# EAGLE design bitcoinChart (EAGLE 9.2.2)
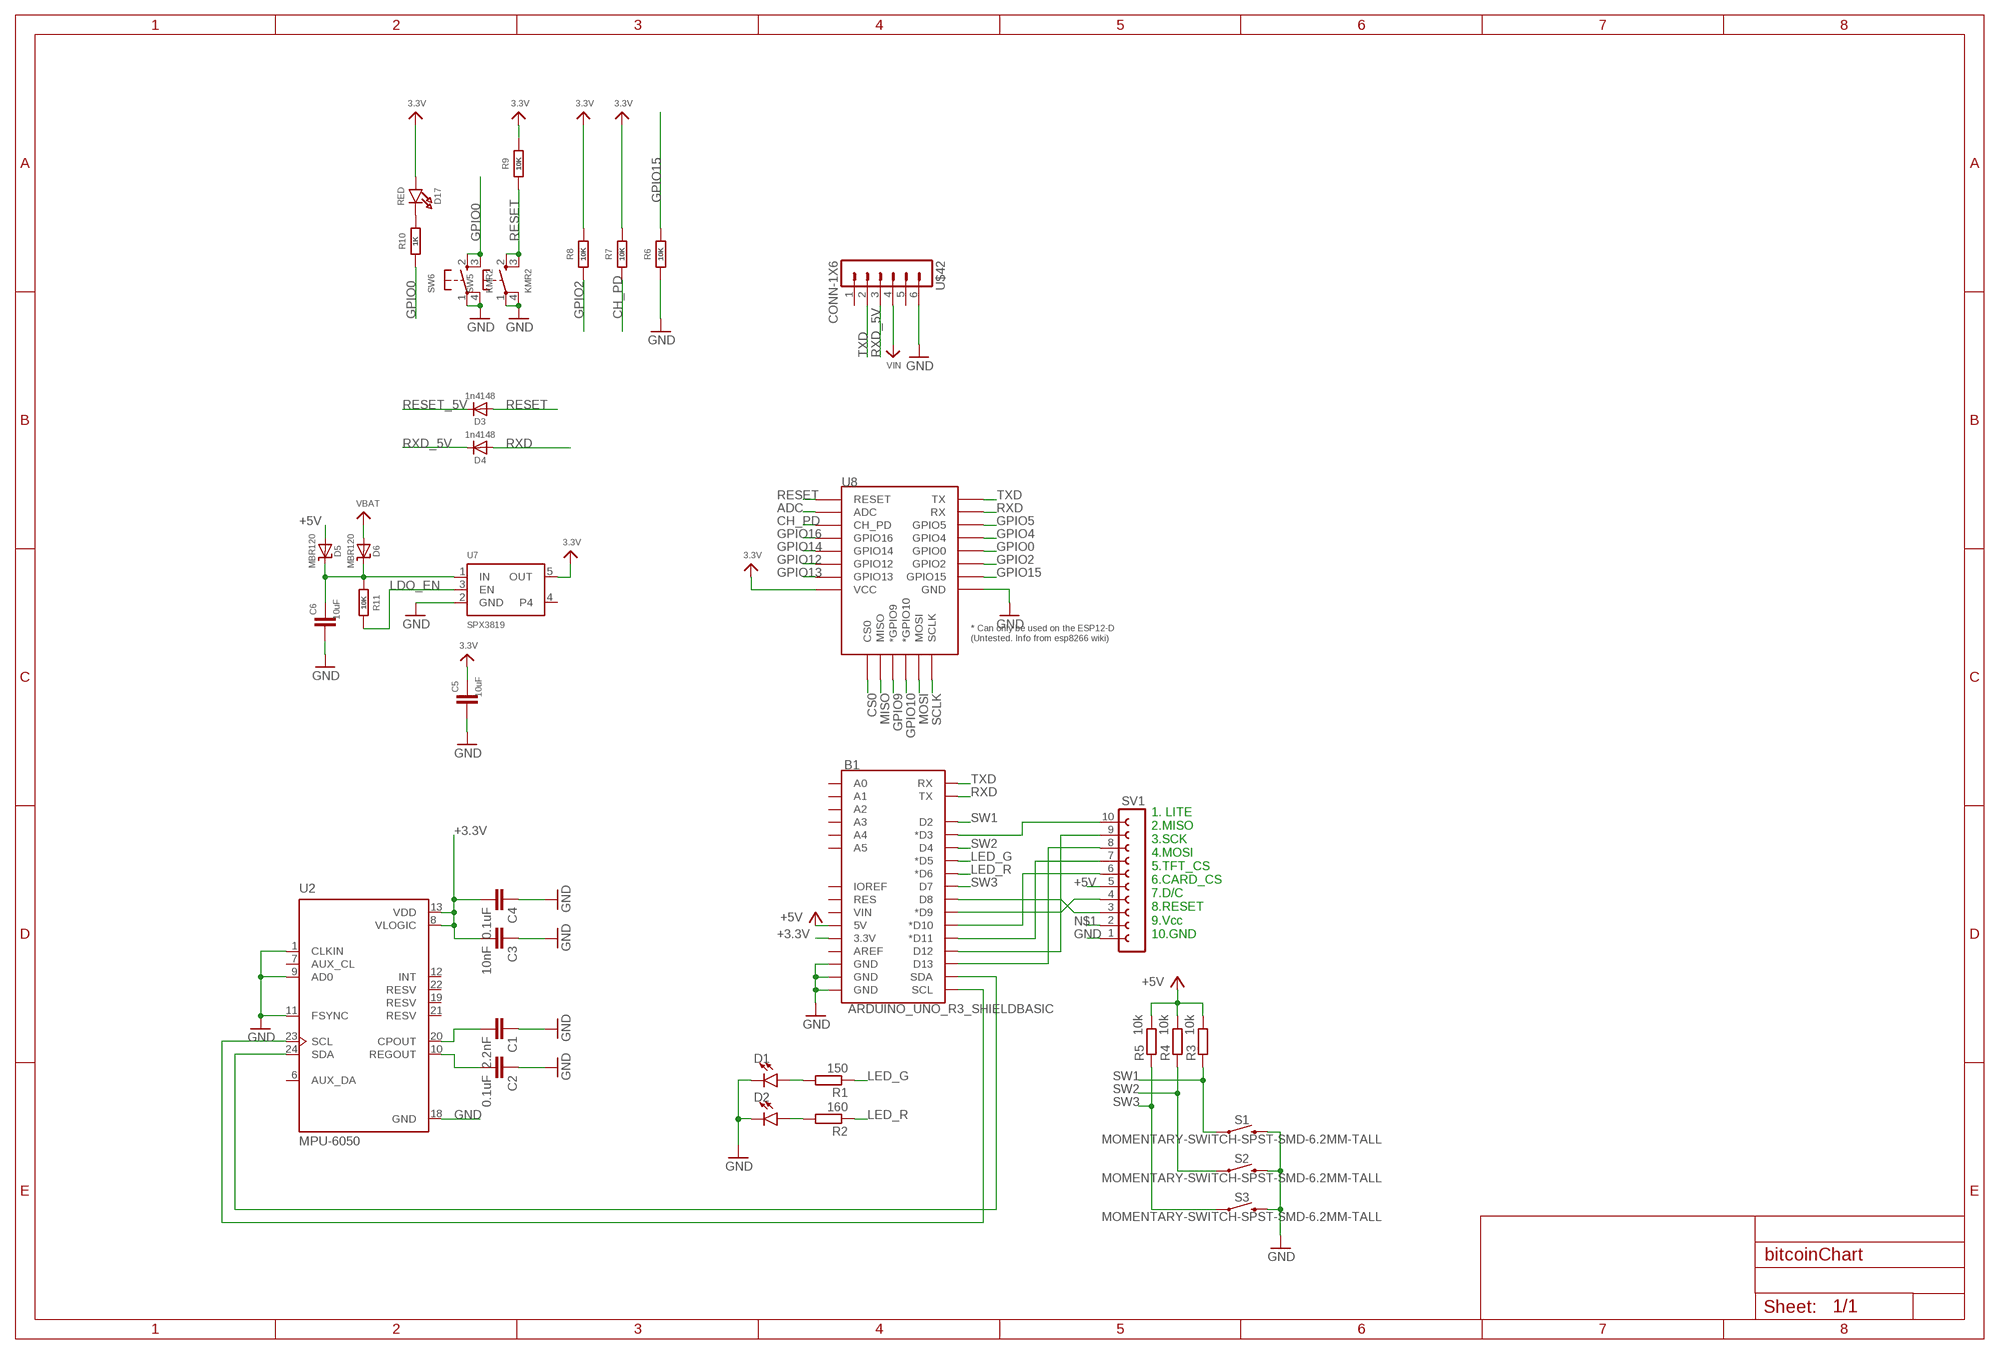
[diagram p0: schematic, sheet 1]

## Parts
B1  ARDUINO_UNO_R3_SHIELDBASIC  [UNO_R3_SHIELD]
C1  2.2nF  C-EUC1206K  [C1206K]
C2  0.1uF  C-EUC1206K  [C1206K]
C3  10nF  C-EUC1206K  [C1206K]
C4  0.1uF  C-EUC1206K  [C1206K]
C5  10uF  SMD-CAPACITOR0805  [C0805K]
C6  10uF  SMD-CAPACITOR0805  [C0805K]
D1  GREEN  LEDCHIPLED_0805  [CHIPLED_0805]
D2  RED  LEDCHIPLED_0805  [CHIPLED_0805]
D3  1n4148  DIODESOD-323  [SOD-323]
D4  1n4148  DIODESOD-323  [SOD-323]
D5  MBR120  DIODE-SCHOTTKYSOD-123  [SOD-123]
D6  MBR120  DIODE-SCHOTTKYSOD-123  [SOD-123]
D17  RED  LED  [LED_0805]
R1  150  R-EU_M1206  [M1206]
R2  160  R-EU_M1206  [M1206]
R3  10k  R-EU_M1206  [M1206]
R4  10k  R-EU_M1206  [M1206]
R5  10k  R-EU_M1206  [M1206]
R6  10K  SMD-RESISTORR0805  [R0805]
R7  10K  SMD-RESISTORR0805  [R0805]
R8  10K  SMD-RESISTORR0805  [R0805]
R9  10K  SMD-RESISTORR0805  [R0805]
R10  1K  SMD-RESISTORR0805  [R0805]
R11  10K  SMD-RESISTORR0805  [R0805]
S1  MOMENTARY-SWITCH-SPST-SMD-6.2MM-TALL  [TACTILE_SWITCH_SMD_6.2MM_TALL]
S2  MOMENTARY-SWITCH-SPST-SMD-6.2MM-TALL  [TACTILE_SWITCH_SMD_6.2MM_TALL]
S3  MOMENTARY-SWITCH-SPST-SMD-6.2MM-TALL  [TACTILE_SWITCH_SMD_6.2MM_TALL]
SV1  FE10-1  [FE10]
SW5  KMR2  BUTTON_KMR2KMR2  [BTN_KMR2]
SW6  KMR2  BUTTON_KMR2KMR2  [BTN_KMR2]
U2  MPU-6050  [QFN50P400X400X95-24N]
U7  SPX3819  MIC5219SOT-23-5  [SOT-23-5]
U8  ESP12ESMD  [ESP12E-SMD]
U$42  CONN-1X6  [GHI-HEADERS_TH-1X6]

## Nets
3.3V [3v]: C5.1 D17.A R7.2 R8.2 R9.2 U7.5(OUT) U8.VCC
+3.3V [test]: B1.3.3V C3.2 C4.2 U2.8(VLOGIC) U2.13(VDD)
+5V [test]: B1.5V D5.2(A) R3.2 R4.2 R5.2 SV1.5
ADC: U8.ADC
CH_PD: R7.1 U8.CH_PD
CS0: U8.CS0
GND [test]: B1.GND@0(GND) B1.GND@1(GND) B1.GND@2(GND) C1.1 C2.1 C3.1 C4.1 C5.2 C6.2 D1.C D2.C R6.1 S1.B2 S2.B2 S3.B2 SV1.1 SW5.1(P) SW5.4(P1) SW6.1(P) SW6.4(P1) U2.1(CLKIN) U2.9(AD0) U2.11(FSYNC) U2.18(GND) U7.2(GND) U8.GND U$42.6
GPIO0: R10.1 SW6.2(S) SW6.3(S1) U8.GPIO0
GPIO2: R8.1 U8.GPIO2
GPIO4: U8.GPIO4
GPIO5: U8.GPIO5
GPIO9: U8.GPIO9(*GPIO9)
GPIO10: U8.GPIO10(*GPIO10)
GPIO12: U8.GPIO12
GPIO13: U8.GPIO13
GPIO14: U8.GPIO14
GPIO15: R6.2 U8.GPIO15
GPIO16: U8.GPIO16
LDO_EN: R11.2 U7.3(EN)
LED_G: B1.D5(*D5) R1.1
LED_R: B1.D6(*D6) R2.1
MISO: U8.MISO
MOSI: U8.MOSI
N$1 [test]: SV1.2
N$2: B1.SCL U2.23(SCL)
N$3: B1.SDA U2.24(SDA)
N$4: B1.D3(*D3) SV1.10
N$5: B1.D8 SV1.3
N$6: B1.D13 SV1.8
N$7: B1.D11(*D11) SV1.7
N$8: B1.D10(*D10) SV1.6
N$9: B1.D9(*D9) SV1.4
N$10: C2.2 U2.10(REGOUT)
N$11: C1.2 U2.20(CPOUT)
N$12: B1.D12 SV1.9
N$13: D1.A R1.2
N$14: C6.1 D5.1(C) D6.1(C) R11.1 U7.1(IN)
N$15: D17.K(C) R10.2
N$16: D2.A R2.2
RESET: D3.2(A) R9.1 SW5.2(S) SW5.3(S1) U8.RESET
RESET_5V: D3.1(C)
RXD: B1.TX D4.2(A) U8.RXD0(RX)
RXD_5V: D4.1(C) U$42.3
SCLK: U8.SCLK
SW1: B1.D2 R3.1 S1.A2
SW2: B1.D4 R4.1 S2.A2
SW3: B1.D7 R5.1 S3.A2
TXD: B1.RX U8.TXD0(TX) U$42.2
VBAT: D6.2(A)
VIN: U$42.4
Unconnected: B1.A0 B1.A1 B1.A2 B1.A3 B1.A4 B1.A5 B1.AREF B1.IOREF B1.RES B1.VIN U2.6(AUX_DA) U2.7(AUX_CL) U2.12(INT) U2.19(RESV) U2.21(RESV) U2.22(RESV) U7.4 U$42.1 U$42.5

## Notes on the sheet
- 1. LITE
  2.MISO
  3.SCK
  4.MOSI
  5.TFT_CS
  6.CARD_CS
  7.D/C
  8.RESET
  9.Vcc
  10.GND

## Library data of the parts
B1 = SparkFun-Boards:ARDUINO_UNO_R3_SHIELD: Arduino R3 Shield Footprint Shield form compatible with the Arduino Uno R3. SparkFun Products: MG2639 Cellular Shield <https://www.sparkfun.com/products/13120> MIDI Shield <https://www.sparkfun.com/products/12898> R3 Stackable Headers Kit <https://www.sparkfun.com/products/11417>
C1-C4 = resistor:C-EU: CAPACITOR, European symbol
C5 C6 = basic_components:SMD-CAPACITOR
D1 D2 = led:LED: LED
D3 D4 = basic_components:DIODE
D5 D6 = basic_components:DIODE-SCHOTTKY
D17 = basic_components:LED: LED
R1-R5 = resistor:R-EU_: RESISTOR, European symbol
R6-R11 = basic_components:SMD-RESISTOR
S1-S3 = SparkFun-Switches:MOMENTARY-SWITCH-SPST: Momentary Switch (Pushbutton) - SPST Normally-open (NO) SPST momentary switches (buttons, pushbuttons). Variants PTH-12MM - 12mm square, through-hole Momentary Pushbutton Switch - 12mm Square <https://www.sparkfun.com/products/9190> (COM-09190) PTH-6.0MM, PTH-6.0MM-KIT - 6.0mm square, through-hole Mini Pushbutton Switch <https://www.sparkfun.com/products/97> (COM-00097) KIT package intended for soldering kit's - only one side of pads' copper is exposed. PTH-RIGHT-ANGLE-KIT - Right-angle, through-hole Right Angle Tactile Button <https://www.sparkfun.com/products/10791> - Used on SparkFun BigTime Watch Kit <https://www.sparkfun.com/products/11734> SMD-12MM - 12mm square, surface-mount Tactile Button - SMD (12mm) <https://www.sparkfun.com/products/12993> (COM-12993) Used on SparkFun PicoBoard <https://www.sparkfun.com/products/11888> SMD-4.5MM - 4.5mm Square Trackball Switch Used on SparkFun Blackberry Trackballer Breakout <https://www.sparkfun.com/products/13169> SMD-4.6MMX2.8MM - 4.60mm x 2.80mm, surface mount Used on SparkFun SAMD21 Mini Breakout <https://www.sparkfun.com/products/13664> SMD-5.2MM, SMD-5.2-REDUNDANT - 5.2mm square, surface-mount Mini Pushbutton Switch - SMD <https://www.sparkfun.com/products/8720> (COM-08720) Used on Arduino Pro Mini <https://www.sparkfun.com/products/11114> REDUNDANT package connects both switch circuits together SMD-6.0X3.5MM - 6.0 x 3.5mm, surface mount Momentary Reset Switch SMD <https://www.sparkfun.com/products/8229> (COM-08229) SMD-6.2MM-TALL - 6.2mm square, surface mount Tactile Button - SMD (6mm) <https://www.sparkfun.com/products/12992> Used on SparkFun Digital Sandbox <https://www.sparkfun.com/products/12651> SMD-RIGHT-ANGLE - Right-angle, surface mount Used on SparkFun Block for Intel® Edison - Arduino <https://www.sparkfun.com/products/13036>; PROD_ID: SWCH-11966; SF_SKU: COM-12992
SV1 = untitled:FE10-1: FEMALE HEADER; OC_FARNELL: unknown; OC_NEWARK: unknown
SW5 SW6 = basic_components:BUTTON_KMR2: SMT Tact Switches 6x6mm - Digikey: P12940SCT-ND KMR2 (4.6x2.8mm) - Digikey: 401-1426-1-ND EVQ-PQHB55 - Light Touch, 160GF (4.5x4.5mm) - Digikey: P8090SCT-ND
U2 = MPU-6050:MPU-6050: MPU-6050 Six-Axis (Gyro + Accelerometer) MEMS MotionTracking™ Devices; AVAILABILITY: Unavailable; DESCRIPTION: 3-axis gyroscope, 3-axis accelerometer in a 4x4x0.9 housing; MF: TDK InvenSense; MP: MPU-6050; PACKAGE: QFN-24 InvenSense; PRICE: None
U7 = basic_components:MIC5219
U8 = basic_components:ESP12E: ESP12E Module
U$42 = basic_components:CONN-1X6

## Net classes
0 default: width 0.152 mm, drill 0.3 mm
1 test: width 0.152 mm, drill 0.4 mm
2 3v: width 0.152 mm, drill 0.3 mm

## Board
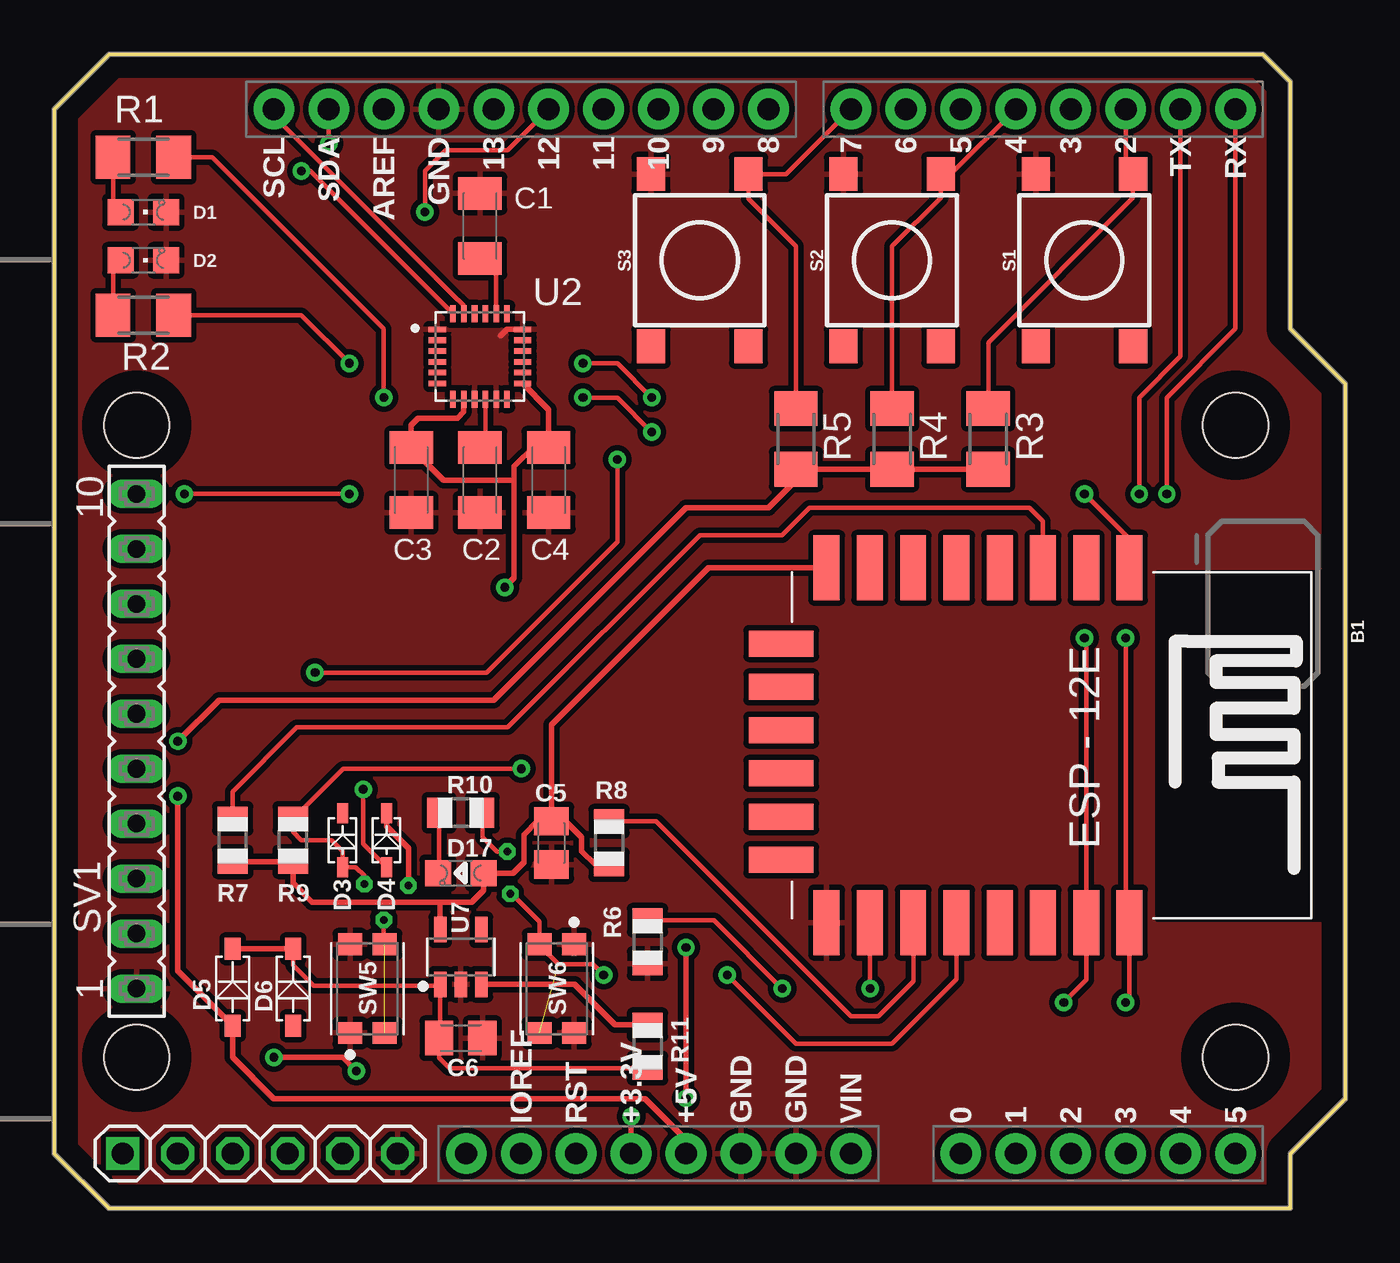
[diagram p1: board, top side]
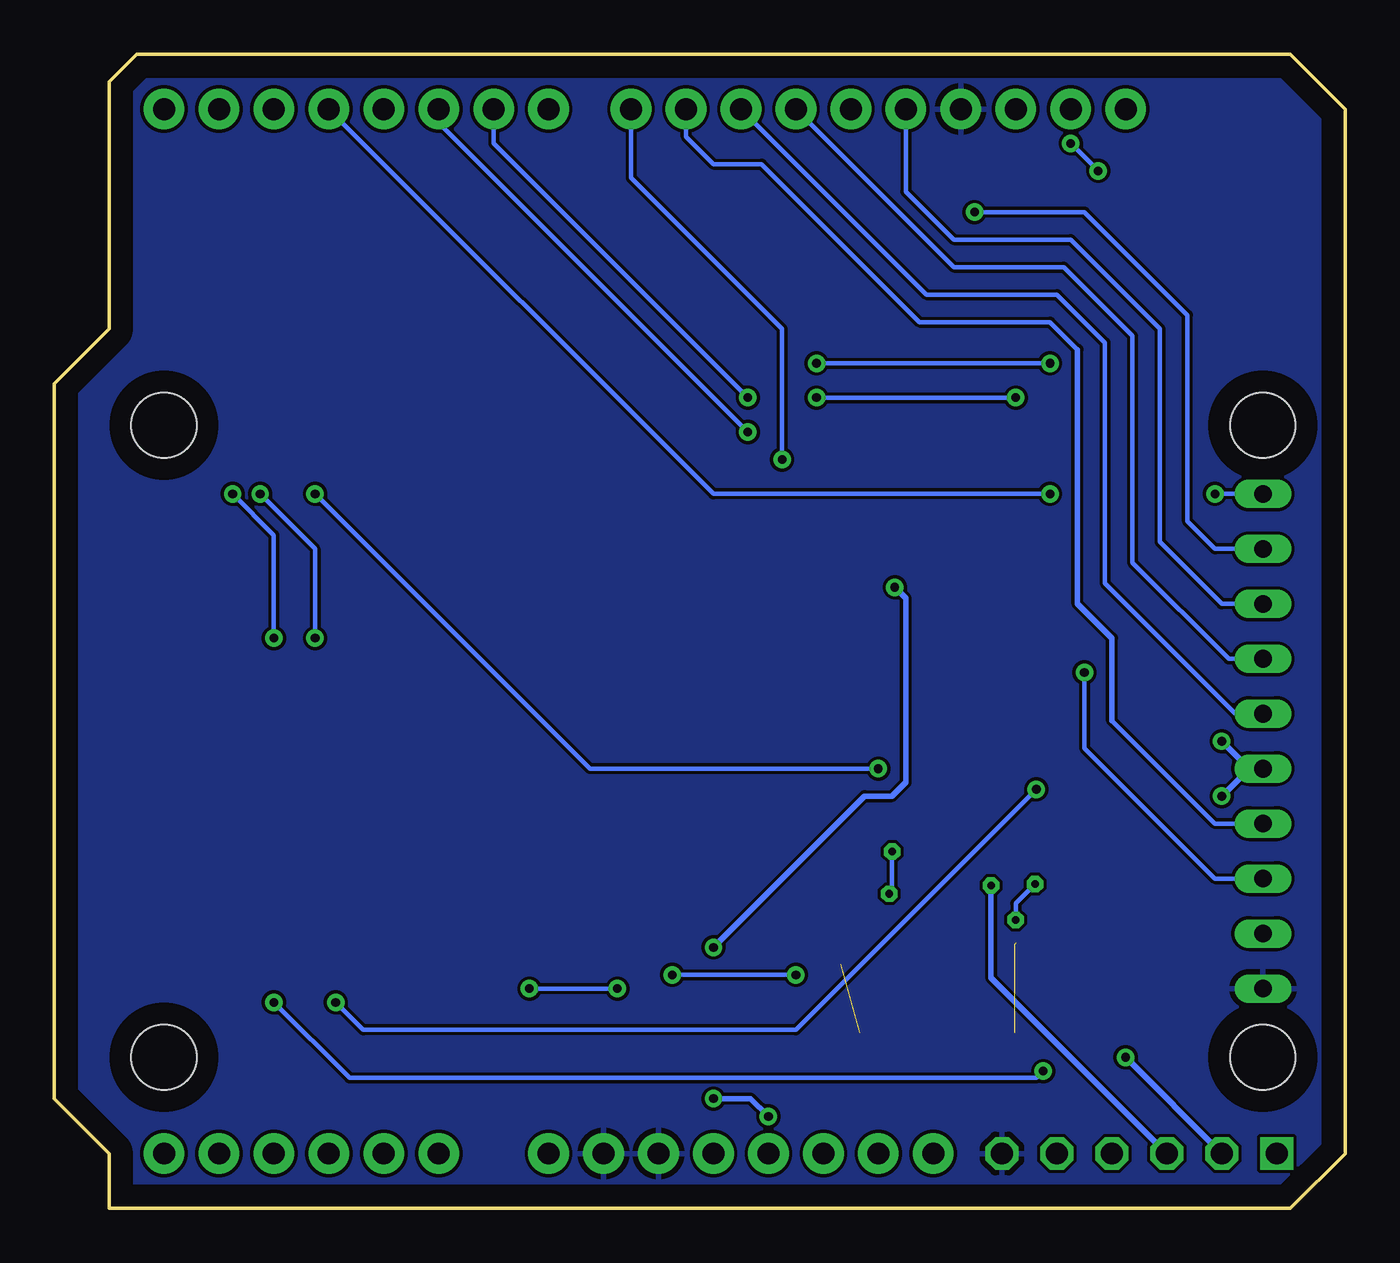
[diagram p2: board, bottom side, seen from below]

Size 59.69 x 53.34 mm. Coordinates in mm from the lower left corner, seen from the top.
Outline: 0,50.8 2.54,53.34 55.88,53.34 57.15,52.07 57.15,40.64 59.69,38.1 59.69,5.08 57.15,2.54 57.15,0 2.54,0 0,2.54 0,50.8
Copper layers (1*16): Top 0.035mm / dielectric 1.5mm / Bottom 0.035mm
Design rules "default": minimum track width 6mil, minimum drill 0.35mm, track to track 6mil, track to pad 6mil, pad to pad 6mil, via to via 6mil, smd to smd 6mil, copper to edge 40mil, drill to drill 6mil, minimum pad ring 10mil, minimum via ring 8mil, stop-mask expansion 4mil, vias tented up to drill 0mil, thermal gap 10mil

### Footprints (pad centres in the part's own frame; a part is rotated, then mirrored left to right if it is on the bottom)
UNO_R3_SHIELD = drill 1.016 pad 1.88: 3.3V 24.13,-2.54; 5V 24.13,0; A0 24.13,12.7; A1 24.13,15.24; A2 24.13,17.78; A3 24.13,20.32; A4 24.13,22.86; A5 24.13,25.4; AREF -24.13,-13.97; D2 -24.13,20.32; D3 -24.13,17.78; D4 -24.13,15.24; D5 -24.13,12.7; D6 -24.13,10.16; D7 -24.13,7.62; D8 -24.13,3.81; D9 -24.13,1.27; D10 -24.13,-1.27; D11 -24.13,-3.81; D12 -24.13,-6.35; D13 -24.13,-8.89; GND@0 24.13,2.54; GND@1 24.13,5.08; GND@2 -24.13,-11.43; IOREF 24.13,-7.62; NC 24.13,-10.16; RES 24.13,-5.08; RX -24.13,25.4; SCL -24.13,-19.05; SDA -24.13,-16.51; TX -24.13,22.86; VIN 24.13,7.62
C1206K = smd 1.5 x 2: 1 -1.5,0; 2 1.5,0
C0805K = smd 1.3 x 1.6: 1 -1,0; 2 1,0
CHIPLED_0805 = smd 1.2 x 1.2: A 0,-1.05; C 0,1.05
SOD-323 = smd 0.921 x 0.497: 1 -1.247,0; 2 1.247,0
SOD-123 = smd 1.01 x 0.73: 1 -1.78,0; 2 1.78,0
LED_0805 = smd 1.2 x 1.2: A 0,1.05; K 0,-1.05
M1206 = smd 1.6 x 2: 1 -1.4,0; 2 1.4,0
R0805 = smd 1.1 x 1.4: 1 -1,0; 2 1,0
TACTILE_SWITCH_SMD_6.2MM_TALL = smd 1.55 x 1.3: A1 -3.975,-2.25; A2 3.975,-2.25; B1 -3.975,2.25; B2 3.975,2.25
FE10 = drill 0.813 long: 1 0,0; 2 0,2.54; 3 0,5.08; 4 0,7.62; 5 0,10.16; 6 0,12.7; 7 0,15.24; 8 0,17.78; 9 0,20.32; 10 0,22.86 | hole 3: 0,-3.175; 0,26.035; 50.8,-3.175; 50.8,26.035
BTN_KMR2 = smd 1.012 x 1.112: 1 -2.05,0.8; 2 -2.05,-0.8; 3 2.05,-0.8; 4 2.05,0.8
QFN50P400X400X95-24N = smd 0.79 x 0.26: 1 -1.97,1.25; 2 -1.97,0.75; 3 -1.97,0.25; 4 -1.97,-0.25; 5 -1.97,-0.75; 6 -1.97,-1.25; 13 1.97,-1.25; 14 1.97,-0.75; 15 1.97,-0.25; 16 1.97,0.25; 17 1.97,0.75; 18 1.97,1.25 | smd 0.26 x 0.79: 7 -1.25,-1.97; 8 -0.75,-1.97; 9 -0.25,-1.97; 10 0.25,-1.97; 11 0.75,-1.97; 12 1.25,-1.97; 19 1.25,1.97; 20 0.75,1.97; 21 0.25,1.97; 22 -0.25,1.97; 23 -0.75,1.97; 24 -1.25,1.97
SOT-23-5 = smd 1.186 x 0.584: 1 -1.264,0.95; 2 -1.264,0; 3 -1.264,-0.95; 4 1.264,-0.95; 5 1.264,0.95
ESP12E-SMD = smd 3 x 1.2: ADC -8.3,3.8; CH_PD -8.3,1.8; GND 8.1,-8.2; GPIO0 8.1,-2.2; GPIO2 8.1,-4.2; GPIO4 8.1,-0.2; GPIO5 8.1,1.8; GPIO12 -8.3,-4.2; GPIO13 -8.3,-6.2; GPIO14 -8.3,-2.2; GPIO15 8.1,-6.2; GPIO16 -8.3,-0.2; RESET -8.3,5.8; RXD0 8.1,3.8; TXD0 8.1,5.8; VCC -8.3,-8.2 | smd 1.2 x 3: CS0 -4.8,-10.3; GPIO9 -0.8,-10.3; GPIO10 1.2,-10.3; MISO -2.8,-10.3; MOSI 3.2,-10.3; SCLK 5.2,-10.3
GHI-HEADERS_TH-1X6 = drill 1.016 square: 1 -6.35,0 | drill 1.016 octagon: 2 -3.81,0; 3 -1.27,0; 4 1.27,0; 5 3.81,0; 6 6.35,0

### Placement (x,y rotation side)
B1  29.21,26.67 270 top
C1  19.69,45.4 270 top
C2  19.69,33.66 90 top
C3  16.51,33.66 90 top
C4  22.86,33.66 90 top
C5  22.99,16.89 270 top
C6  18.8,7.87 0 top
D1  4.13,46.04 270 top
D2  4.13,43.81 270 top
D3  13.33,17.02 270 top
D4  15.37,17.02 270 top
D5  8.25,10.22 270 top
D6  11.05,10.22 270 top
D17  18.8,15.49 270 top
R1  4.13,48.58 180 top
R2  4.13,41.27 180 top
R3  43.18,35.56 270 top
R4  38.73,35.56 270 top
R5  34.29,35.56 270 top
R6  27.43,12.32 90 top
R7  8.25,17.02 270 top
R8  25.65,16.89 270 top
R9  11.05,17.02 270 top
R10  18.8,18.29 180 top
R11  27.43,7.49 90 top
S1  47.62,43.81 90 top
S2  38.73,43.81 90 top
S3  29.84,43.81 90 top
SV1  3.81,10.16 0 top
SW5  14.48,10.16 90 top
SW6  23.24,10.16 270 top
U2  19.69,39.37 0 top
U7  18.8,11.62 90 top
U8  43.91,21.3 270 top
U$42  9.52,2.54 0 top

### Tracks (layer width: path | path; a pad name or v marks a point on that pad's centre or on a via)
3.3V
  Top 0.254: U7.5 17.85,14.16 | 17.85,14.16 11.94,14.16 11.05,15.05 R9.2 R7.2 | 17.85,14.16 19.3,14.16 19.85,14.7 D17.A 21.21,15.49 21.72,16 21.72,17.27 22.35,17.91 22.37,17.89 C5.1 | C5.1 23.64,17.89 24.38,17.14 24.38,16.51 25.02,15.88 25.64,15.88 R8.2 | C5.1 22.99,22.35 30.24,29.6 U8.VCC
+3.3V  (via drill 0.4)
  Top 0.203: 22.22,35.24 22.31,35.16
  Top 0.254: B1.3.3V v26.67,4.25 | v29.21,5.08 v29.21,12.07 | 21.27,33.66 21.27,29.15 v20.83,28.7 | U2.13 22.86,36.91 C4.2 22.31,35.16 | U2.8 18.94,36.81 18.64,36.51 16.83,36.51 16.51,36.2 C3.2 18.01,33.66 21.27,33.66 | 21.27,33.66 21.27,34.29 22.22,35.24
  Bottom 0.254: v26.67,4.25 27.5,5.08 v29.21,5.08 | v29.21,12.07 22.22,19.05 20.95,19.05 20.32,19.68 20.32,28.19 v20.83,28.7
+5V  (via drill 0.4)
  Top 0.254: D5.2 8.26,8.37 | D5.2 8.25,6.98 10.16,5.08 27.3,5.08 29.21,3.18 B1.5V | R3.2 R4.2 R5.2 34.29,33.66 33.02,32.38 29.21,32.38 20.32,23.49 7.62,23.49 v5.72,21.59 | D5.2 5.72,10.98 | 5.72,10.98 | 5.72,10.98 v5.72,19.05
  Bottom 0.254: v5.72,21.59 4.44,20.32 | 4.44,20.32 SV1.5 | v5.72,19.05 4.44,20.32
ANTENNA
  cutout Top: 58.74,29.4 50.99,29.4 50.99,13.34 58.74,13.34
CH_PD
  Top 0.203: U8.CH_PD 45.71,31.76 45.09,32.38 34.93,32.38 33.66,31.12 29.84,31.12 20.95,22.23 11.22,22.23 8.25,19.26 R7.1
  Top 0.6: 45.72,29.61 U8.CH_PD
GND
  Top 0.254: U2.18 20.94,40.62 20.64,40.32
  pour Bottom: 0,50.8 0,2.54 2.54,0 57.15,0 57.15,2.54 59.69,5.08 59.69,38.1 57.15,40.64 57.15,52.07 55.88,53.34 2.54,53.34
  pour Top (isolate 0.254): 0,50.8 0,2.54 2.54,0 57.15,0 57.15,2.54 59.69,5.08 59.69,38.1 57.15,40.64 57.15,52.07 55.88,53.34 2.54,53.34
GPIO0  (via drill 0.35, 0.4)  (1 unrouted)
  Top 0.203: SW6.2 22.44,13.25 21.15,14.54 | R10.1 19.8,17.16 20.47,16.49 v20.95,16.49 | U8.GPIO0 41.71,10.59 38.73,7.62 34.29,7.62 v31.12,10.8 | v25.4,10.8 24.92,11.28 23.31,11.28 22.52,12.07
  Top 0.254: 21.15,14.54 v21.08,14.54 | 22.44,11.85 22.44,12.07 | 22.44,12.07 SW6.2 | 22.52,12.07 22.44,12.07
  Bottom 0.203: v20.95,16.49 20.95,14.67 v21.08,14.54 | v31.12,10.8 v25.4,10.8
GPIO2
  Top 0.203: R8.1 27.83,17.89 36.83,8.89 38.1,8.89 39.71,10.5 U8.GPIO2
GPIO15  (via drill 0.4)
  Top 0.203: R6.2 30.5,13.32 v33.66,10.16 | 37.66,13.15 U8.GPIO15 v37.72,10.16
  Bottom 0.203: v33.66,10.16 v37.72,10.16
LDO_EN
  Top 0.254: U7.3 24.06,10.36 25.92,8.49 R11.2
LED_G  (via drill 0.4)
  Top 0.203: v27.62,35.88 26.03,37.47 v24.45,37.47 | v15.24,37.47 15.24,40.64 7.3,48.58 R1.1
  Bottom 0.203: B1.D5 41.91,50.16 v27.62,35.88 | v24.45,37.47 v15.24,37.47
LED_R  (via drill 0.4)
  Top 0.203: v27.62,37.47 26.03,39.05 v24.45,39.05 | v13.65,39.05 11.43,41.27 R2.1
  Bottom 0.203: B1.D6 39.37,49.21 v27.62,37.47 | v24.45,39.05 v13.65,39.05
N$2
  Top 0.203: U2.23 18.94,41.72 18.67,41.99 18.65,41.99 10.16,50.48 B1.SCL
  Top 0.254: 18.94,41.39 U2.23
N$3  (via drill 0.4)
  Top 0.203: U2.24 11.83,47.94 v11.43,47.94 | v12.7,49.21 B1.SDA
  Top 0.254: 18.44,41.38 U2.24
  Bottom 0.203: v11.43,47.94 v12.7,49.21
N$4  (via drill 0.4)
  Top 0.203: v6.03,33.02 v13.65,33.02
  Bottom 0.203: SV1.10 v6.03,33.02 | v13.65,33.02 29.21,33.02 B1.D3
N$5  (via drill 0.4)
  Top 0.203: v26.03,34.61 26.03,30.8 20,24.77 v12.06,24.77
  Bottom 0.203: B1.D8 33.02,47.62 26.03,40.64 v26.03,34.61 | v12.06,24.77 12.06,21.27 6.03,15.24 SV1.3
N$6
  Bottom 0.203: SV1.8 5.72,27.94 8.57,30.8 8.57,40.64 12.7,44.77 18.1,44.77 20.32,46.99 B1.D13
N$7  (via drill 0.4)
  Bottom 0.203: SV1.7 5.4,25.4 9.84,29.84 9.84,40.32 13.02,43.5 18.1,43.5 B1.D11 25.4,50.16
  other vias: 3.81,25.4
N$8
  Bottom 0.203: SV1.6 5.08,22.86 11.11,28.89 11.11,40.01 13.33,42.23 19.37,42.23 B1.D10
N$9
  Bottom 0.203: SV1.4 6.03,17.78 10.8,22.54 | B1.D9 30.48,49.53 29.21,48.26 26.99,48.26 19.69,40.96 13.65,40.96 12.38,39.69
  Bottom 0.254: 10.8,22.54 10.8,26.35 12.38,27.94 12.38,39.69
N$10
  Top 0.203: U2.10 19.94,35.41 C2.2
N$11
  Top 0.203: U2.20 20.44,43.15 C1.2
N$12  (via drill 0.4)
  Top 0.203: v17.14,46.04 17.14,47.94 18.1,48.9 20.95,48.9 B1.D12
  Bottom 0.203: SV1.9 6.03,30.48 7.3,31.75 7.3,41.27 12.06,46.04 v17.14,46.04
N$13
  Top 0.203: 2.63,48.48 R1.2 2.73,46.39 D1.A
N$14
  Top 0.203: D6.1 11.05,11.24 12,10.29 17.78,10.29 | U7.1 17.85,7.92 | C6.1 17.8,6.97 18.29,6.48 27.42,6.48
  Top 0.254: 17.78,10.29 U7.1 | 17.85,7.92 C6.1 | 27.42,6.48 R11.1 | D5.1 D6.1
N$15
  Top 0.203: R10.2 17.8,15.54
  Top 0.254: 17.8,15.54 D17.K
N$16
  Top 0.203: 2.63,41.38 R2.2 2.73,43.47 D2.A
RESET  (via drill 0.35, 0.4)  (2 unrouted)
  Top 0.203: v14.35,14.99 14.35,15.37 13.95,15.77 D3.2 13.33,16.51 12.83,17.02 11.43,17.02 11.05,17.4 R9.1 13.35,20.32 v21.59,20.32 | v15.24,13.34 15.24,12.25 | v47.62,33.02 49.71,30.94 U8.RESET
  Top 0.254: v15.24,13.34 15.28,13.3
  Bottom 0.203: v14.35,14.99 15.24,14.1 v15.24,13.34 | v21.59,20.32 34.93,20.32 v47.62,33.02
RXD  (via drill 0.4)
  Top 0.203: B1.TX 52.07,39.37 50.16,37.47 v50.16,33.02 | D4.2 14.29,16.85 v14.29,19.37 | v46.67,9.52 47.71,10.56 U8.RXD0 47.71,26.27 v47.62,26.35
  Top 0.254: D4.2 15.23,15.77
  Bottom 0.203: v14.29,19.37 25.4,8.25 45.4,8.25 v46.67,9.52 | v50.16,33.02 47.62,30.48 v47.62,26.35
RXD_5V  (via drill 0.35)
  Top 0.254: D4.1 15.37,17.65 16.38,16.64 v16.38,14.92
  Bottom 0.254: v16.38,14.92 16.38,10.67 U$42.3
SW1
  Top 0.203: R3.1 43.18,40.01 49.88,46.7 S1.A2 49.53,48.13 B1.D2
SW2
  Top 0.203: R4.1 38.73,37.47 38.73,37.59 38.73,44.45 40.98,46.7 S2.A2 41.44,47.79 B1.D4
SW3
  Top 0.203: B1.D7 33.82,47.79 S3.A2 32.09,46.65 34.29,44.45 R5.1
TXD  (via drill 0.4)
  Top 0.203: B1.RX 54.61,40.64 51.44,37.47 v51.44,33.02 | v49.53,9.52 49.71,9.71 U8.TXD0 49.53,13.38 v49.53,26.35
  Top 0.254: v10.16,6.98 13.33,6.98 v13.97,6.35
  Bottom 0.203: v13.97,6.35 14.29,6.03 46.04,6.03 v49.53,9.52 | v51.44,33.02 49.53,31.12 v49.53,26.35
  Bottom 0.254: U$42.2 v10.16,6.98